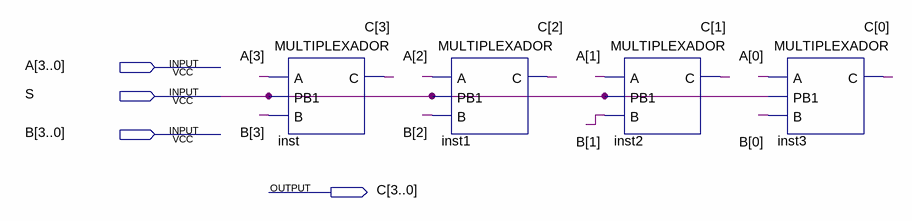
[diagram p0: schematic sheet]
// Quartus schematic MULTIPLEXADOR4BITS.bdf as structural Verilog: 4 symbols, 4 pins
module MULTIPLEXADOR4BITS (
  input  [3:0] A,
  input  S,
  input  [3:0] B,
  output [3:0] C
);

  MULTIPLEXADOR inst (.A(A[3]), .PB1(S), .B(B[3]), .C(C[3]));
  MULTIPLEXADOR inst1 (.A(A[2]), .PB1(S), .B(B[2]), .C(C[2]));
  MULTIPLEXADOR inst2 (.A(A[1]), .PB1(S), .B(B[1]), .C(C[1]));
  MULTIPLEXADOR inst3 (.A(A[0]), .PB1(S), .B(B[0]), .C(C[0]));
endmodule
